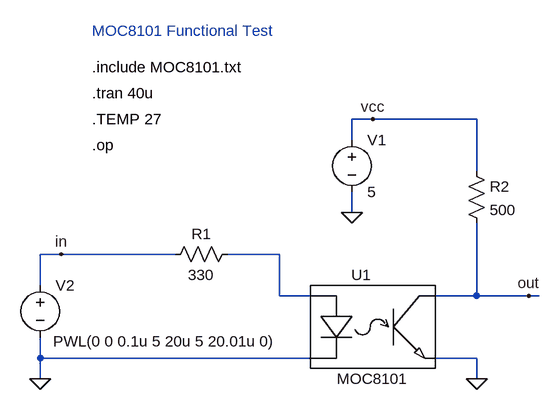
[diagram p0: schematic MOC8101_func_test1.asc]
MOC8101_func_test1.asc, the LTspice schematic file:
Version 4
SHEET 1 2328 1460
WIRE 432 528 400 528
WIRE 592 528 432 528
WIRE 400 560 400 528
WIRE 592 608 592 528
WIRE 400 672 400 640
WIRE -48 736 -80 736
WIRE 128 736 -48 736
WIRE 288 736 208 736
WIRE -80 784 -80 736
WIRE 288 800 288 736
WIRE 336 800 288 800
WIRE 592 800 592 688
WIRE 592 800 528 800
WIRE 672 800 592 800
WIRE 688 800 672 800
WIRE -80 896 -80 864
WIRE 336 896 -80 896
WIRE 592 896 528 896
WIRE -80 928 -80 896
WIRE 592 928 592 896
FLAG 400 672 0
FLAG 592 928 0
FLAG 432 528 vcc
FLAG -80 928 0
FLAG -48 736 in
FLAG 672 800 out
SYMBOL voltage 400 544 R0
SYMATTR InstName V1
SYMATTR Value 5
SYMBOL res 112 752 R270
WINDOW 0 32 56 VTop 0
WINDOW 3 0 56 VBottom 0
SYMATTR InstName R1
SYMATTR Value 330
SYMBOL voltage -80 768 R0
WINDOW 3 20 102 Left 0
WINDOW 123 0 0 Left 0
WINDOW 39 0 0 Left 0
SYMATTR Value PWL(0 0 0.1u 5 20u 5 20.01u 0)
SYMATTR InstName V2
SYMBOL res 576 592 R0
SYMATTR InstName R2
SYMATTR Value 500
SYMBOL MOC8101 432 848 R0
SYMATTR InstName U1
TEXT 0 392 Left 0 ;MOC8101 Functional Test
TEXT 0 488 Left 0 !.tran 40u
TEXT 0 568 Left 0 !.op
TEXT 0 528 Left 0 !.TEMP 27
TEXT 0 448 Left 0 !.include MOC8101.txt

The netlist it stands for:
* MOC8101_func_test1.asc
V1 vcc 0 5
R1 in N001 330
V2 in 0 PWL(0 0 0.1u 5 20u 5 20.01u 0)
R2 vcc out 500
XU1 N001 0 out 0 MOC8101  ; pins A K C E
* MOC8101 Functional Test
.tran 40u
.op
.TEMP 27
.include MOC8101.txt
.backanno
.end